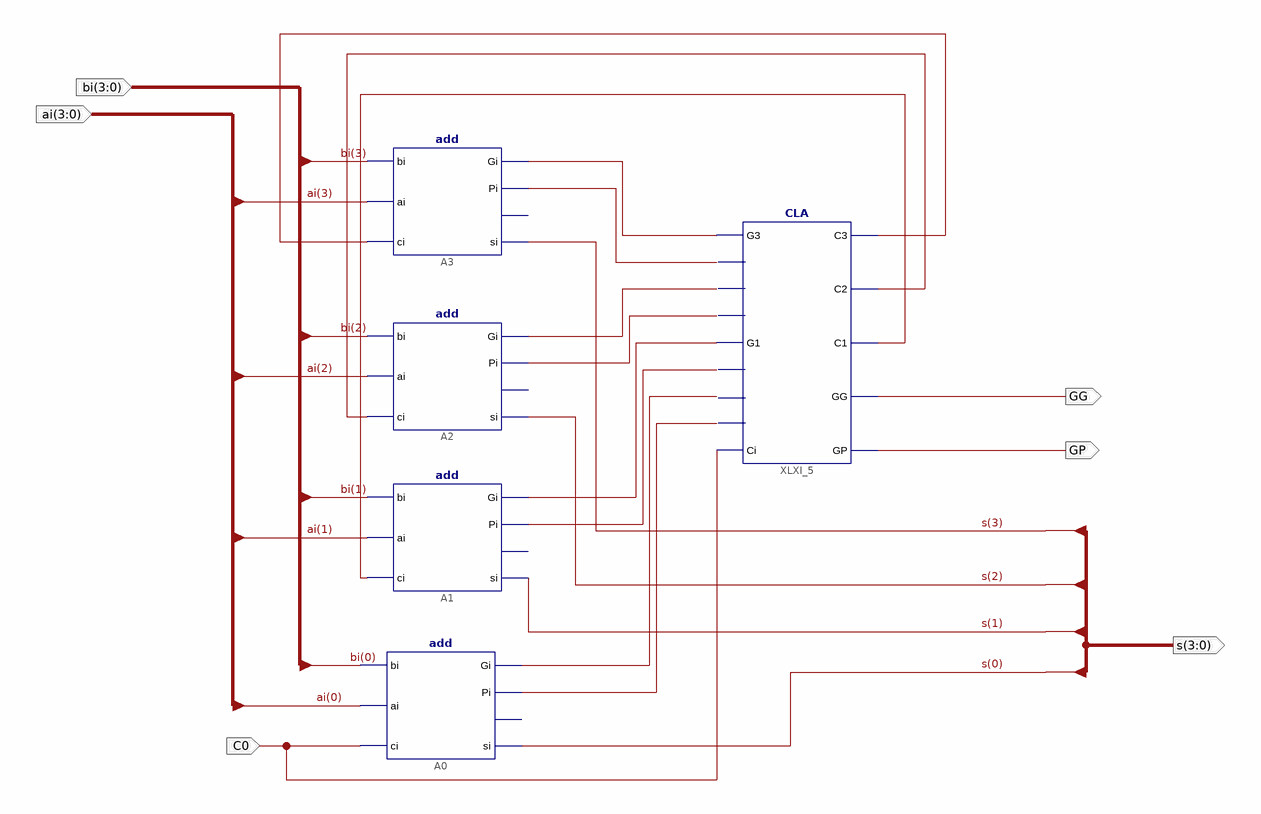
[diagram p0: schematic sheet 1]
// Xilinx ISE schematic add4b.sch (kintex7) as structural Verilog: 5 symbols, 6 ports
module add4b (
  input  [3:0] bi,
  input  [3:0] ai,
  input  C0,
  output GP,
  output GG,
  output [3:0] s
);

  wire XLXN_15, XLXN_16, XLXN_17, XLXN_22, XLXN_23, XLXN_24, XLXN_25, XLXN_26, XLXN_27, XLXN_28, XLXN_30;

  add A3 (.bi(bi[3]), .ai(ai[3]), .ci(XLXN_15), .si(s[3]), .Gi(XLXN_22), .Pi(XLXN_23));  // open: co
  add A2 (.bi(bi[2]), .ai(ai[2]), .ci(XLXN_16), .si(s[2]), .Gi(XLXN_24), .Pi(XLXN_25));  // open: co
  add A1 (.bi(bi[1]), .ai(ai[1]), .ci(XLXN_17), .si(s[1]), .Gi(XLXN_26), .Pi(XLXN_27));  // open: co
  CLA XLXI_5 (
    .G1(XLXN_26), .G3(XLXN_22), .P2(XLXN_25), .G2(XLXN_24), .P3(XLXN_23), .P1(XLXN_27), .G0(XLXN_28),
    .Ci(C0), .P0(XLXN_30), .C3(XLXN_15), .C2(XLXN_16), .C1(XLXN_17), .GG(GG), .GP(GP));
  add A0 (.bi(bi[0]), .ai(ai[0]), .ci(C0), .si(s[0]), .Gi(XLXN_28), .Pi(XLXN_30));  // open: co
endmodule
